# Altium schematic sheet MCUreal.SchDoc
size 420 x 297 mm; SheetNumber: 1; SheetTotal: 1
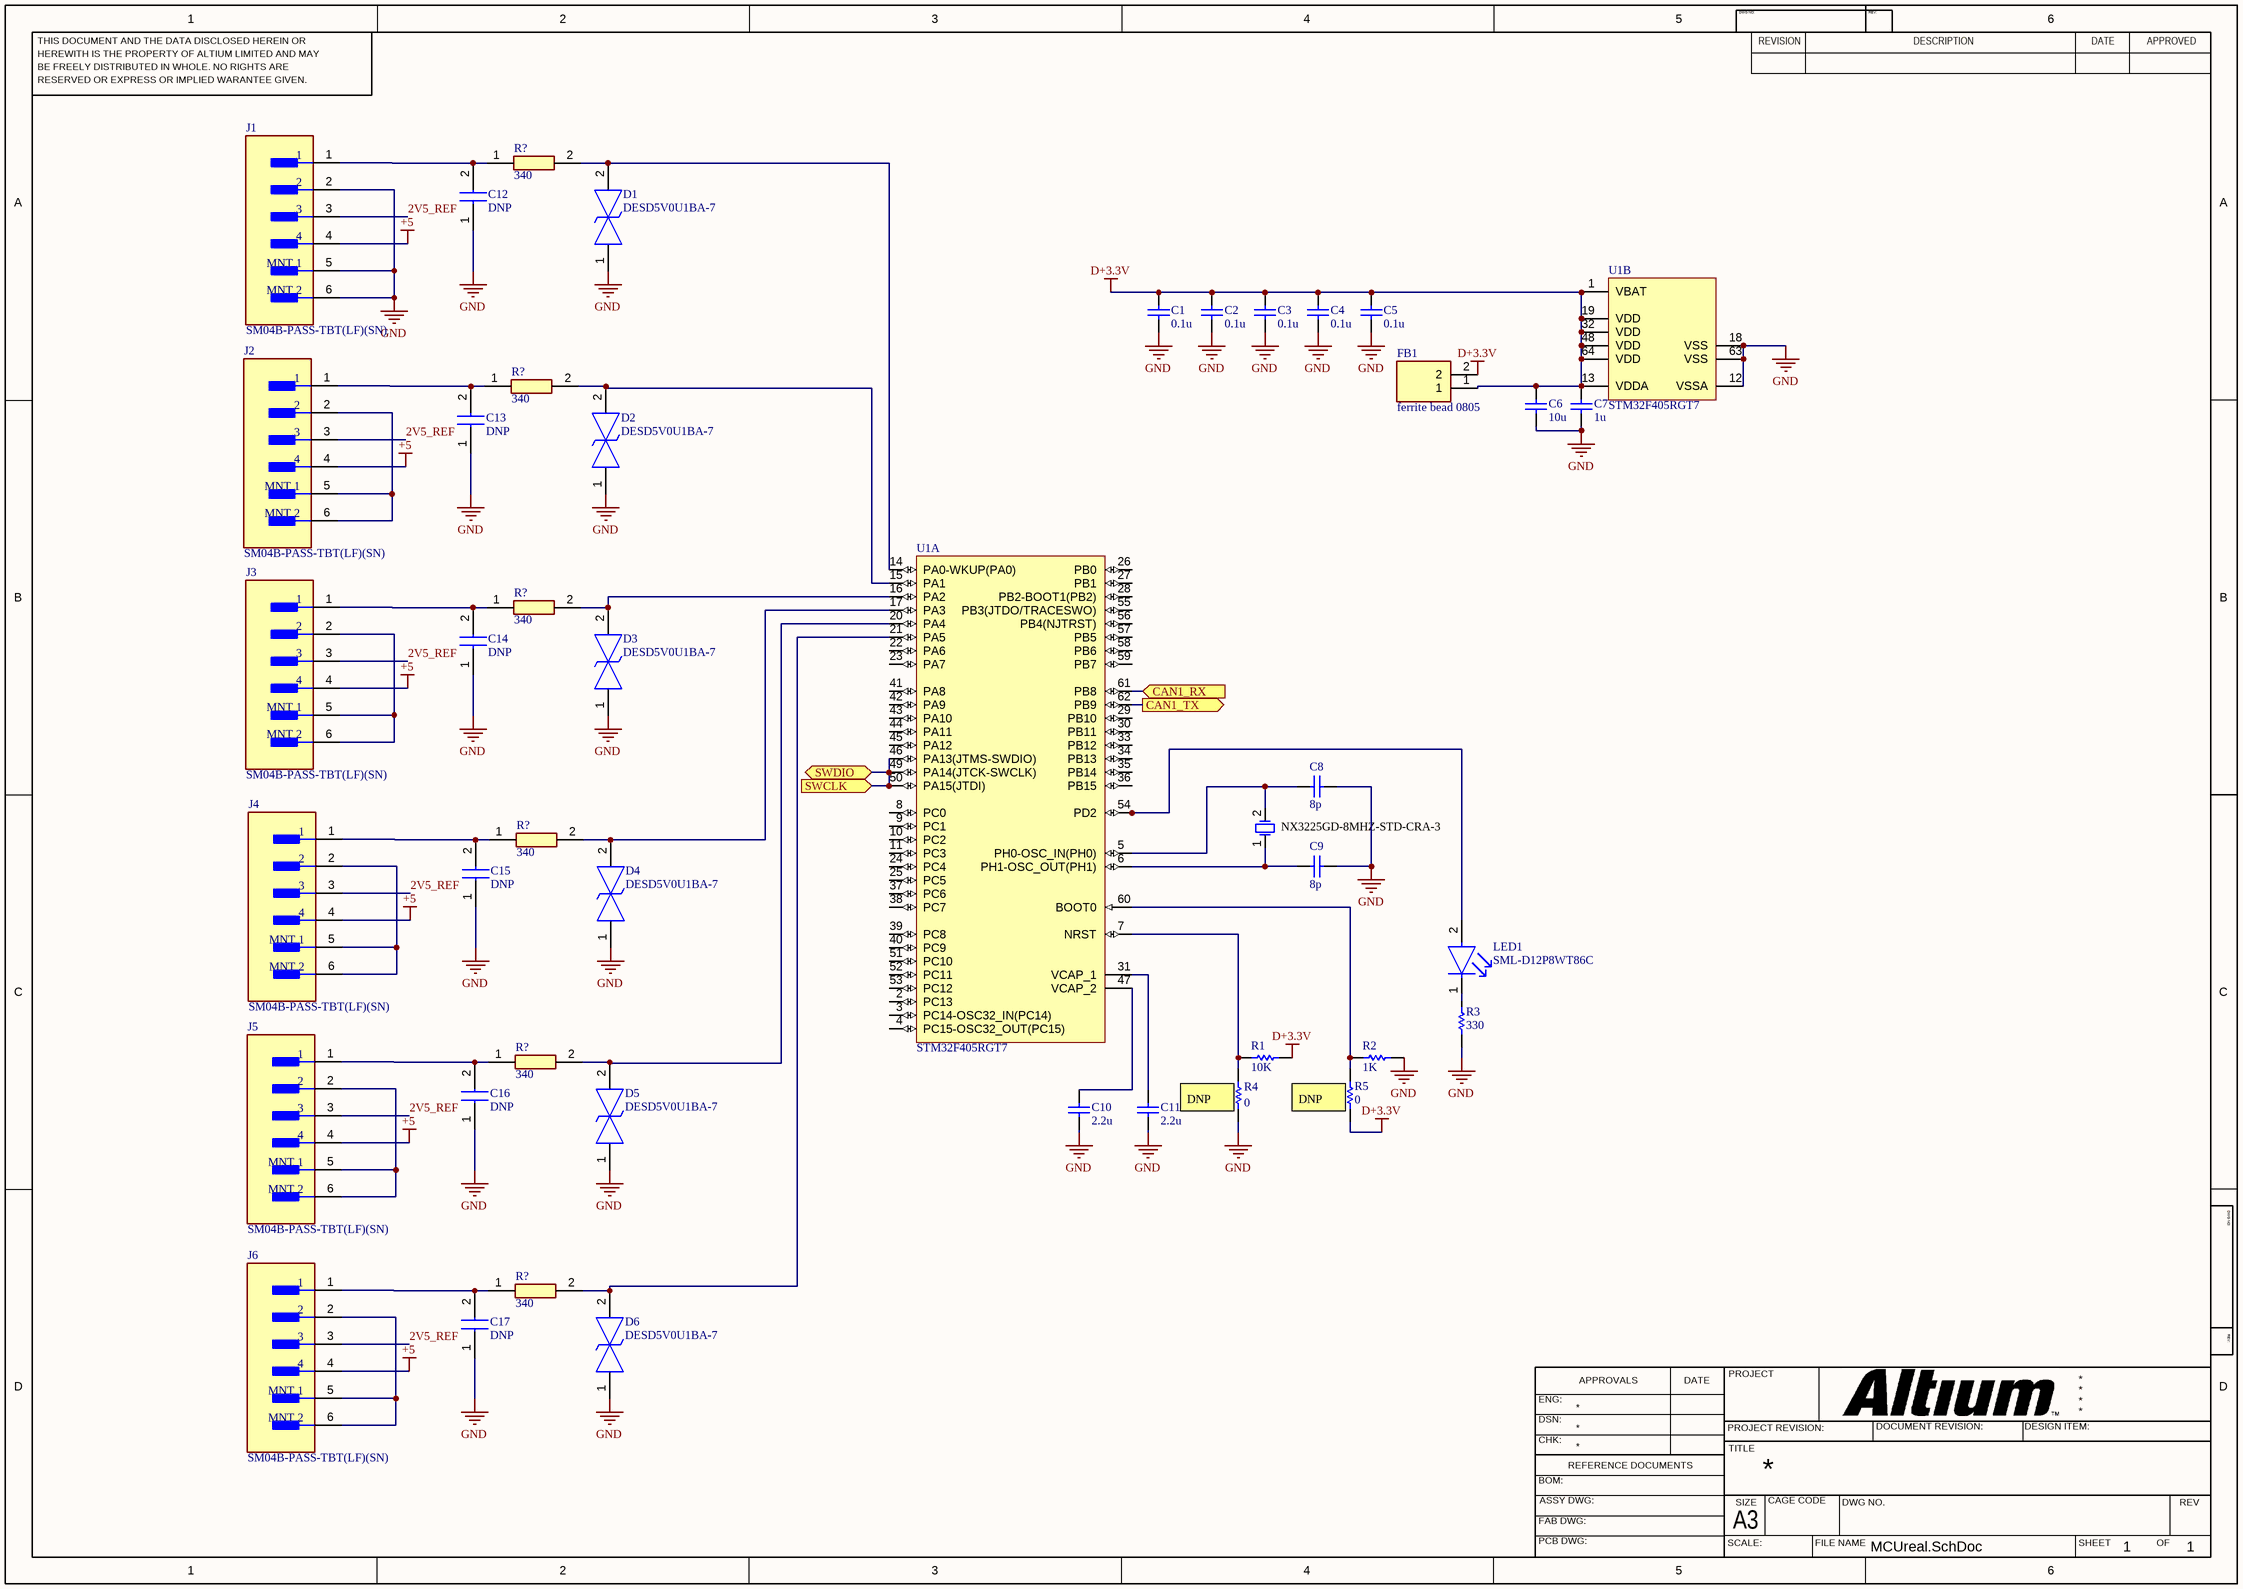
[diagram p0: MCUreal.SchDoc]

## Parts
(Parts that share a designator on the sheet are numbered #1, #2 ... from top to bottom, then left to right.)
?  NX3225GD-8MHZ-STD-CRA-3  [NDK-NX3225GD-8MHZ-STD-CRA-3_V]
C1  value 0.1u  (hidden comment: Capacitor)
C2  value 0.1u  (hidden comment: Capacitor)
C3  value 0.1u  (hidden comment: Capacitor)
C4  value 0.1u  (hidden comment: Capacitor)
C5  value 0.1u  (hidden comment: Capacitor)
C6  value 10u  (hidden comment: Capacitor)
C7  value 1u  (hidden comment: Capacitor)
C8  value 8p  (hidden comment: Capacitor)
C9  value 8p  (hidden comment: Capacitor)
C10  value 2.2u  (hidden comment: Capacitor)
C11  value 2.2u  (hidden comment: Capacitor)
C12  DNP  [CAPC1608X90N]
C13  DNP  [CAPC1608X90N]
C14  DNP  [CAPC1608X90N]
C15  DNP  [CAPC1608X90N]
C16  DNP  [CAPC1608X90N]
C17  DNP  [CAPC1608X90N]
D1  DESD5V0U1BA-7  [SOD2513X120N]
D2  DESD5V0U1BA-7  [SOD2513X120N]
D3  DESD5V0U1BA-7  [SOD2513X120N]
D4  DESD5V0U1BA-7  [SOD2513X120N]
D5  DESD5V0U1BA-7  [SOD2513X120N]
D6  DESD5V0U1BA-7  [SOD2513X120N]
FB1  ferrite bead 0805  [BEADC2012X105N]
J1  SM04B-PASS-TBT(LF)(SN)  [FP-SM04B-PASS-TBT_LF_SN-MFG]
J2  SM04B-PASS-TBT(LF)(SN)  [FP-SM04B-PASS-TBT_LF_SN-MFG]
J3  SM04B-PASS-TBT(LF)(SN)  [FP-SM04B-PASS-TBT_LF_SN-MFG]
J4  SM04B-PASS-TBT(LF)(SN)  [FP-SM04B-PASS-TBT_LF_SN-MFG]
J5  SM04B-PASS-TBT(LF)(SN)  [FP-SM04B-PASS-TBT_LF_SN-MFG]
J6  SM04B-PASS-TBT(LF)(SN)  [FP-SM04B-PASS-TBT_LF_SN-MFG]
LED1  SML-D12P8WT86C  [FP-SML-D12-MFG]
R1  value 10K  (hidden comment: Resistor)
R2  value 1K  (hidden comment: Resistor)
R3  value 330  (hidden comment: Resistor)
R4  value 0  (hidden comment: Resistor)
R5  R3: 0  (hidden comment: Resistor)
R?#1  340  [RESC1608X55N]
R?#2  340  [RESC1608X55N]
R?#3  340  [RESC1608X55N]
R?#4  340  [RESC1608X55N]
R?#5  340  [RESC1608X55N]
R?#6  340  [RESC1608X55N]
U1  STM32F405RGT7  [STM-LQFP64_N]  (parts A,B of 2)

## Ports
CAN1_RX (in), CAN1_TX (out), SWCLK (in), SWDIO (bidir)

## Nets
+5: J1.4 J2.4 J3.4 J4.4 J5.4 J6.4
D+3.3V: C1.2 C2.2 C3.2 C4.2 C5.2 C6.2 C7.2 FB1.1 FB1.2 R1.2 R5.1 U1.1(VBAT) U1.13(VDDA) U1.19(VDD) U1.32(VDD) U1.48(VDD) U1.64(VDD)
GND: C1.1 C2.1 C3.1 C4.1 C5.1 C6.1 C7.1 C8.2 C9.2 C10.1 C11.1 C12.1 C13.1 C14.1 C15.1 C16.1 C17.1 D1.1 D2.1 D3.1 D4.1 D5.1 D6.1 J1.2 J1.5(MNT_1) J1.6(MNT_2) R2.2 R3.1 R4.1 U1.12(VSSA) U1.18(VSS) U1.63(VSS)
2V5_REF: J1.3 J2.3 J3.3 J4.3 J5.3 J6.3
CAN1_RX: U1.61(PB8) ; port CAN1_RX
CAN1_TX: U1.62(PB9) ; port CAN1_TX
SWCLK: U1.46(PA13(JTMS-SWDIO)) U1.49(PA14(JTCK-SWCLK)) U1.50(PA15(JTDI)) ; port SWCLK, port SWDIO
Net?_1: ?.1 C9.1 U1.6(PH1-OSC_OUT(PH1))
Net?_2: ?.2 C8.1 U1.5(PH0-OSC_IN(PH0))
NetC10_2: C10.2 U1.47(VCAP_2)
NetC11_2: C11.2 U1.31(VCAP_1)
NetC12_2: C12.2 J1.1 R?#1.1
NetC13_2: C13.2 J2.1 R?#2.1
NetC14_2: C14.2 J3.1 R?#3.1
NetC15_2: C15.2 J4.1 R?#4.1
NetC16_2: C16.2 J5.1 R?#5.1
NetC17_2: C17.2 J6.1 R?#6.1
NetD1_2: D1.2 R?#1.2 U1.14(PA0-WKUP(PA0))
NetD2_2: D2.2 R?#2.2 U1.15(PA1)
NetD3_2: D3.2 R?#3.2 U1.16(PA2)
NetD4_2: D4.2 R?#4.2 U1.17(PA3)
NetD5_2: D5.2 R?#5.2 U1.20(PA4)
NetD6_2: D6.2 R?#6.2 U1.21(PA5)
NetJ2_2: J2.2 J2.5(MNT_1) J2.6(MNT_2)
NetJ3_2: J3.2 J3.5(MNT_1) J3.6(MNT_2)
NetJ4_2: J4.2 J4.5(MNT_1) J4.6(MNT_2)
NetJ5_2: J5.2 J5.5(MNT_1) J5.6(MNT_2)
NetJ6_2: J6.2 J6.5(MNT_1) J6.6(MNT_2)
NetLED1_1: LED1.1(C) R3.2
NetLED1_2: LED1.2(A) U1.54(PD2)
NetR1_1: R1.1 R4.2 U1.7(NRST)
NetR2_1: R2.1 R5.2 U1.60(BOOT0)

Not connected (* = marked no-connect by the designer): U1 2(PC13) 3(PC14-OSC32_IN(PC14)) 4(PC15-OSC32_OUT(PC15)) 8(PC0) 9(PC1) 10(PC2) 11(PC3) 22(PA6) 23(PA7) 24(PC4) 25(PC5) 26(PB0) 27(PB1) 28(PB2-BOOT1(PB2)) 29(PB10) 30(PB11) 33(PB12) 34(PB13) 35(PB14) 36(PB15) 37(PC6) 38(PC7) 39(PC8) 40(PC9) 41(PA8) 42(PA9) 43(PA10) 44(PA11) 45(PA12) 51(PC10) 52(PC11) 53(PC12) 55(PB3(JTDO/TRACESWO)) 56(PB4(NJTRST)) 57(PB5) 58(PB6) 59(PB7)

## Notes on the sheet
- (near R4) DNP
- (near R5) DNP
- THIS DOCUMENT AND THE DATA DISCLOSED HEREIN OR
- HEREWITH IS THE PROPERTY OF ALTIUM LIMITED AND MAY
- DWG NO:
- REVISION
- REV:
- DESCRIPTION
- DATE
- APPROVED
- BE FREELY DISTRIBUTED IN WHOLE. NO RIGHTS ARE
- RESERVED OR EXPRESS OR IMPLIED WARANTEE GIVEN.
- ENG:
- APPROVALS
- PROJECT
- DSN:
- CHK:
- REFERENCE DOCUMENTS
- PROJECT REVISION:
- TITLE
- DOCUMENT REVISION:
- DESIGN ITEM:
- BOM:
- FAB DWG:
- PCB DWG:
- ASSY DWG:
- SCALE:
- A3
- SIZE
- CAGE CODE
- FILE NAME
- DWG NO.
- SHEET
- OF
- REV

## Library data of the parts
? = CMP-2000-07595-1: Crystal Unit, 8 MHz, 8 pF, -40 to 150 degC, 2-Pin SMD, RoHS, Tape and Reel; Manufacturer: NDK; Load Capacitance: 8pF; ESR (Equivalent Series Resistance): 500Ohm; Frequency Tolerance: 50ppm; Frequency Stability: 150ppm; Frequency: 8MHz; Case/Package: SMD/SMT; Datasheet Version: 11/2016; Min Operating Temperature: -40degC; Packaging: TapeandReel; Width: 0.098inch; Package Quantity: 3000; Number of Pins: 2; Package Description: 2-Pin Surface Mount Device, Body 3.2 x 2.5 mm; RoHSCompliant: True; Package Reference: NX3225GD-8MHZ-STD-CRA-3; Datasheet URL: http://www.ndk.com/images/products/catalog/c_NX3225GD-STD-CRA-3_e.pdf; Mounting Technology: SurfaceMount; Length: 0.126inch; Mount: SurfaceMount; Manufacturer URL: http://www.ndk.com/en/; Max Operating Temperature: 150degC; Height: 0.039inch
C1-C11 = Capacitor: SimulationGenericComponent: True
C12-C17 = CL10B225KP8NNNC: Manufacturer_Name: SAMSUNG; Datasheet Link: https://datasheet.datasheetarchive.com/originals/distributors/Datasheets-DGA10/2411679.pdf; Height: 0.9mm; Manufacturer_Part_Number: CL10B225KP8NNNC; Mouser Part Number: 187-CL10B225KP8NNNC; Mouser Price/Stock: https://www.mouser.co.uk/ProductDetail/Samsung-Electro-Mechanics/CL10B225KP8NNNC?qs=X6jEic%2FHinDbk4bW6Red9A%3D%3D; Arrow Part Number: CL10B225KP8NNNC; Arrow Price/Stock: https://www.arrow.com/en/products/cl10b225kp8nnnc/samsung-electro-mechanics?region=nac
D1-D6 = DESD5V0U1BA-7: TVS Diode (Bi-directional); Manufacturer_Name: Diodes Incorporated; Datasheet Link: https://www.diodes.com//assets/Datasheets/DESD5V0U1BA.pdf; Height: 1.2mm; Manufacturer_Part_Number: DESD5V0U1BA-7; Mouser Part Number: 621-DESD5V0U1BA-7; Mouser Price/Stock: https://www.mouser.co.uk/ProductDetail/Diodes-Incorporated/DESD5V0U1BA-7?qs=wtVJq%252Be05r98RUWcs2LyvQ%3D%3D; Arrow Part Number: DESD5V0U1BA-7; Arrow Price/Stock: https://www.arrow.com/en/products/desd5v0u1ba-7/diodes-incorporated?region=nac
FB1 = FBMJ2125HS250NT: Manufacturer_Name: TAIYO YUDEN; Datasheet Link: https://mouser.componentsearchengine.com/Datasheets/1/FBMJ2125HS250NT.pdf; Height: 1.05mm; Manufacturer_Part_Number: FBMJ2125HS250NT; Mouser Part Number: 963-FBMJ2125HS250NT; Mouser Price/Stock: https://www.mouser.co.uk/ProductDetail/TAIYO-YUDEN/FBMJ2125HS250NT?qs=I6KAKw0tg2w%2F7qNkMvc%2FCQ%3D%3D; Arrow Part Number: FBMJ2125HS250NT; Arrow Price/Stock: null?region=nac
J1-J6 = CMP-2000-07078-2: CONN HEADER SMD R/A 4POS 2MM; Manufacturer: JST; Voltage Rating: 250V; Current Rating: 3A; Conn Gender: Male; Conn Orientation: Right Angle; Number Of Contacts: 4; Height: 5.7mm; Contact Material: Tin; Device Class L2: Headers and Wire Housings; Number Of Rows: 1; Device Class L1: Connectors; RoHS: TRUE; Lead Free: Yes; Automotive: No; Digikey Description: CONN HEADER SMD R/A 4POS 2MM; Manufacturer Part Number: SM04B-PASS-TBT(LF)(SN); Temperature: -25°C to +85°C; Package: SM04B-PASS-TBT(LF)(SN); Temperature Range Low: -25°C; ComponentLink2Description: Datasheet; Temperature Range High: +85°C; Pitch: 2mm; ComponentLink2URL: http://www.jst-mfg.com/product/pdf/eng/ePA-F.pdf; Octopart: https://octopart.com/sm04b-pass-tbt%28lf%29%28sn%29-jst-3990422; Category: Conn; Device Class L3: unset
LED1 = CMP-08952-000001-1: LED GREEN 1608 SMD; Manufacturer: Rohm; Forward Current: 20mA; Luminous Intensity: 6.3mcd; Wavelength: 560nm; Automotive Grade: Grade 3; Reverse Voltage: 5V; Forward Voltage: 2.2V; Power Dissipation: 54mW; Led Orientation: Top View; Temperature Range Low: -40°C; Automotive: Yes; Height: 0.65mm; Manufacturer Part Number: SML-D12P8WT86C; Device Class L3: unset; Octopart: https://octopart.com/sml-d12p8wt86c-rohm-77740213; Lead Free: Yes; Digikey Description: LED GREEN 1608 SMD; Temperature Range High: +85°C; ComponentLink2URL: https://www.rohm.com/datasheet/SML-D12P8W(C)/sml-d12x8(c)-e; ComponentLink2Description: Datasheet; RoHS: TRUE; Device Class L2: LEDs; Package: SML-D12; Category: Diode; Temperature: -40°C to +85°C; Mouser Description: LED Uni-Color Green Automotive 2-Pin Chip 0603(1608Metric) T/R; Colour: Green; Device Class L1: Optoelectronics
R1-R3 = Resistor: TC1: 0; SimulationGenericComponent: True; TC2: 0
R4 R5 = Resistor: SimulationGenericComponent: True; TC1: 0; TC2: 0
R?#1-R?#6 = RC0603FR-07340RL: Manufacturer_Name: KEMET; Datasheet Link: http://www.yageo.com/documents/recent/PYu-RC0603_51_RoHS_L_v5.pdf; Height: 0.55mm; Manufacturer_Part_Number: RC0603FR-07340RL
U1 = CMP-0243-00093-2: ARM Cortex-M4 32-bit MCU+FPU, 210 DMIPS, 1024 kB Flash, 192 kB Internal RAM, 51 I/Os, 64-pin LQFP, -40 to 105 degC, Tray; Manufacturer: STMicroelectronics; D/A Converter: 2x12-bit; Internal RAM Size (kB): 192; Supply Voltage(Vcc) min (V): 1.8; Supply Voltage(Vcc) max (V): 3.6; FLASH Size (Prog) (kB): 1024; I/Os (High Current): 51; Operating Frequency(F) (Processor speed) (MHz): 168; PackageVersion: Rev. 4, 06/2013; PackageDescription: 64-Pin Low Profile Quad Flat Package, 10 x 10 mm Body, 0.5 mm Pitch; Packing: Tray; ComponentLink2Description: Datasheet; PackageReference: LQFP64; ComponentLink1URL: http://www.st.com/web/en/home.html; ComponentLink2URL: http://www.st.com/st-web-ui/static/active/en/resource/technical/document/datasheet/DM00037051.pdf; ComponentLink1Description: Manufacturer URL; Core: ARM Cortex-M4; PartNumber: STM32F405RGT7; Mounting Technology: Surface Mount; DatasheetVersion: Rev. 4; ComponentLink3URL: http://www.st.com/st-web-ui/static/active/en/resource/technical/document/datasheet/DM00037051.pdf; ComponentLink3Description: Package Specification